# Altium project Apollo_ES_board.PrjPcb
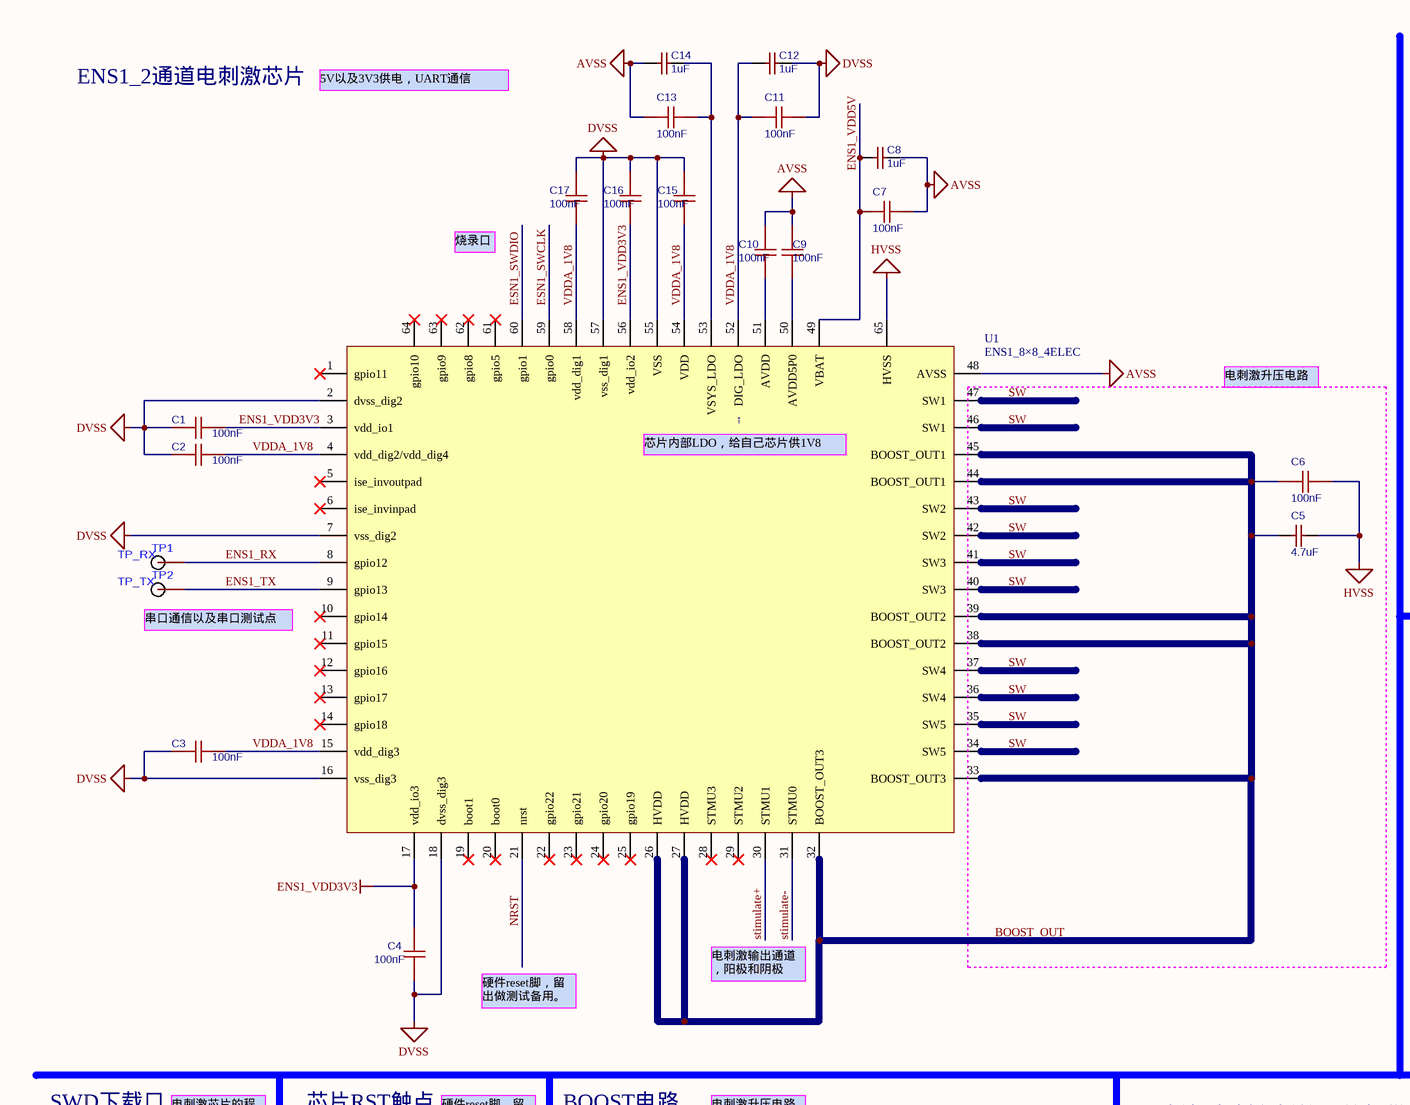
[diagram p0: Apollo_ES_Board.SchDoc, top left]
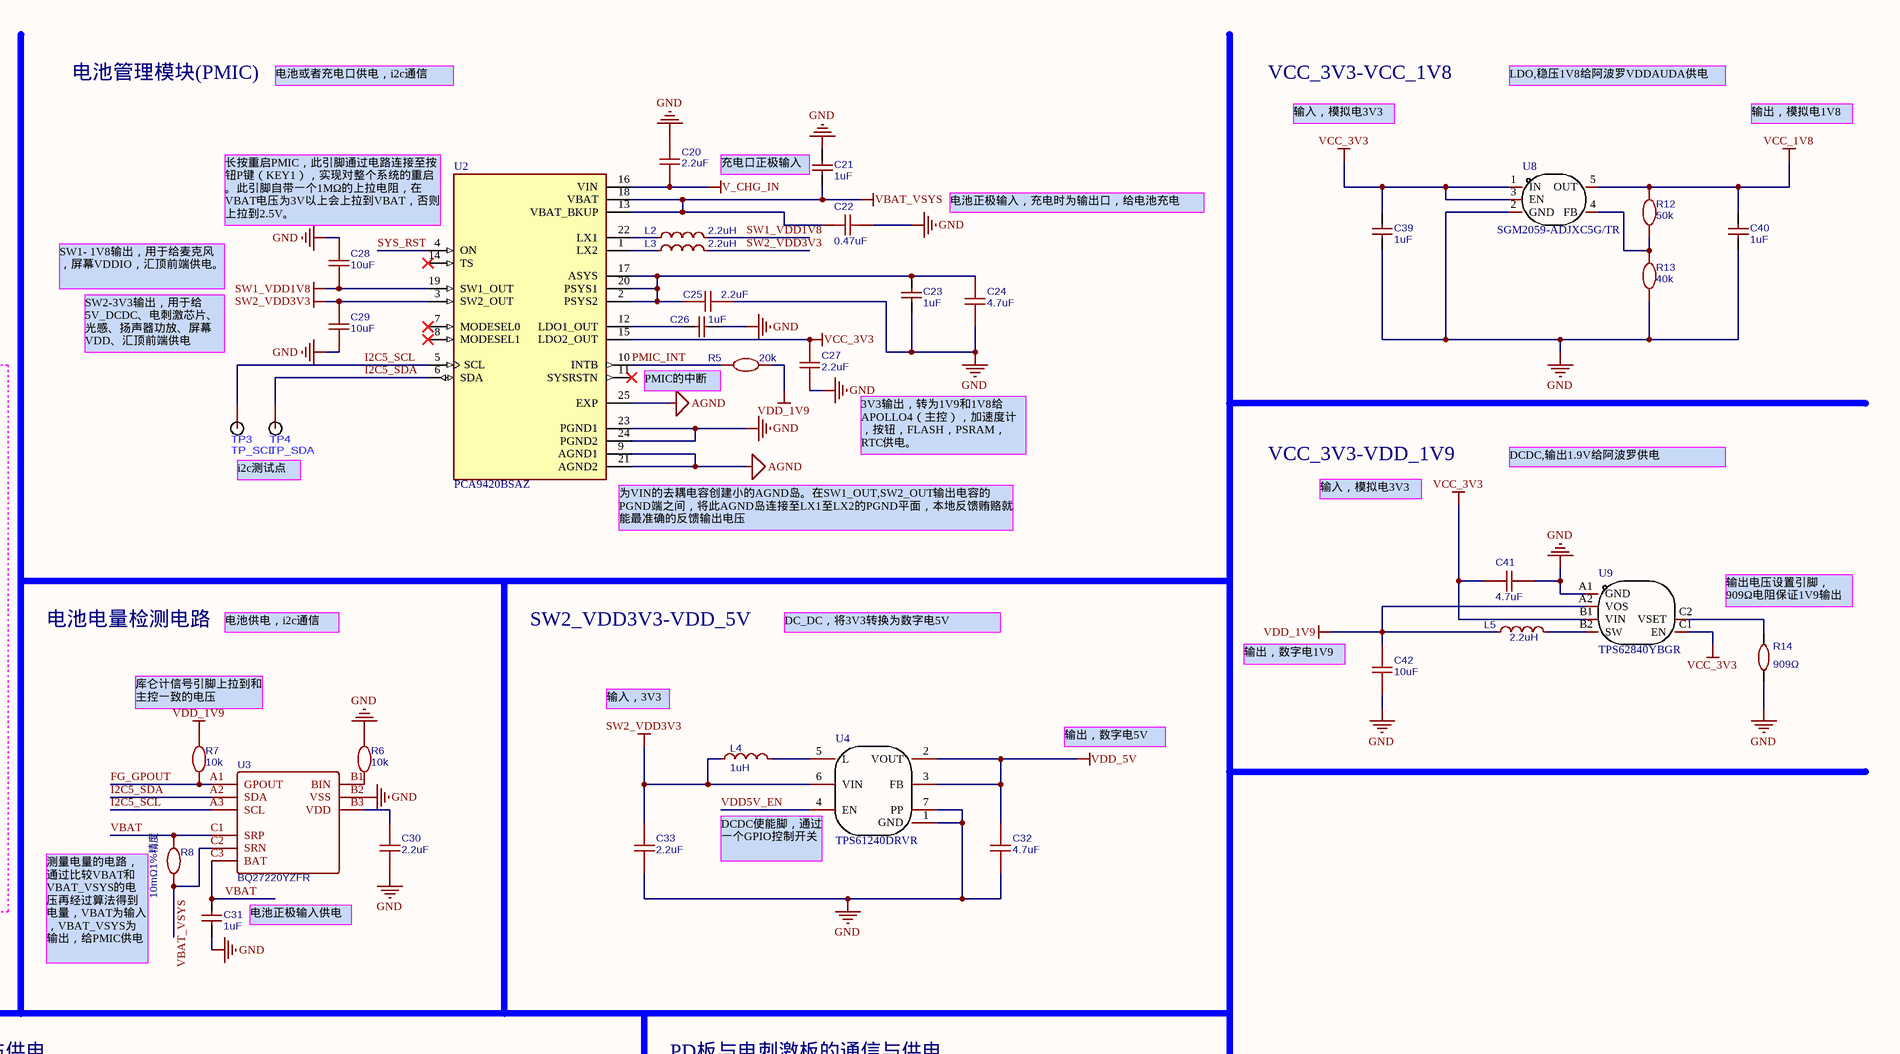
[diagram p1: Apollo_ES_Board.SchDoc, top right]
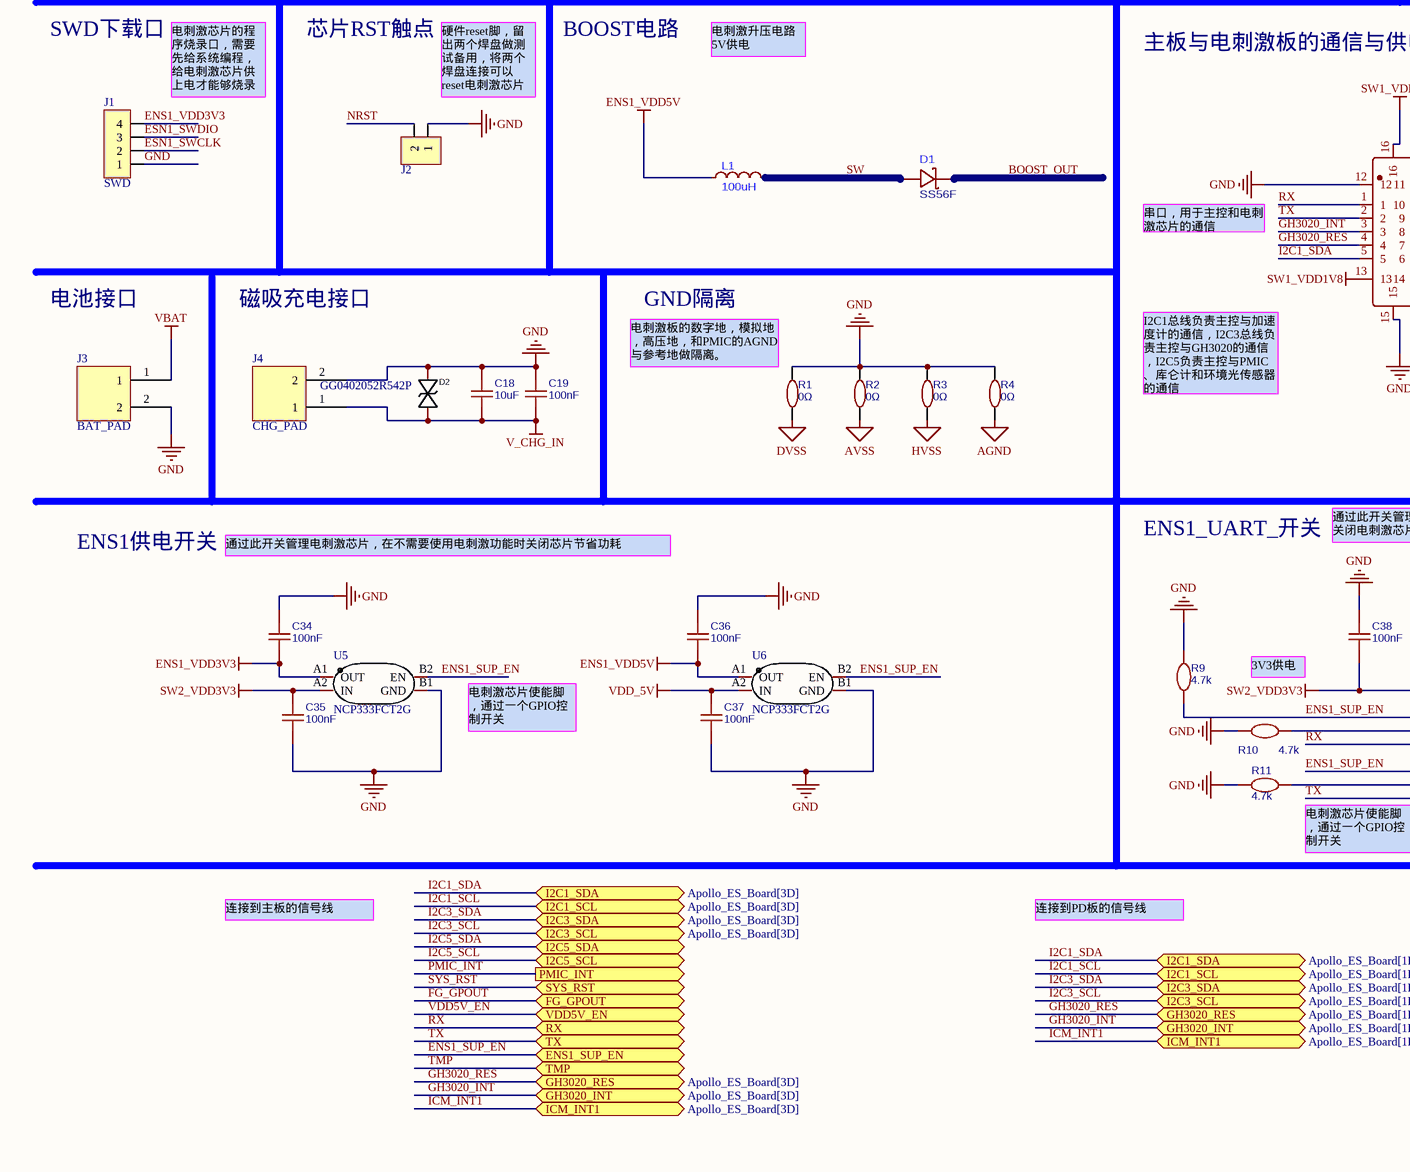
[diagram p2: Apollo_ES_Board.SchDoc, bottom left]
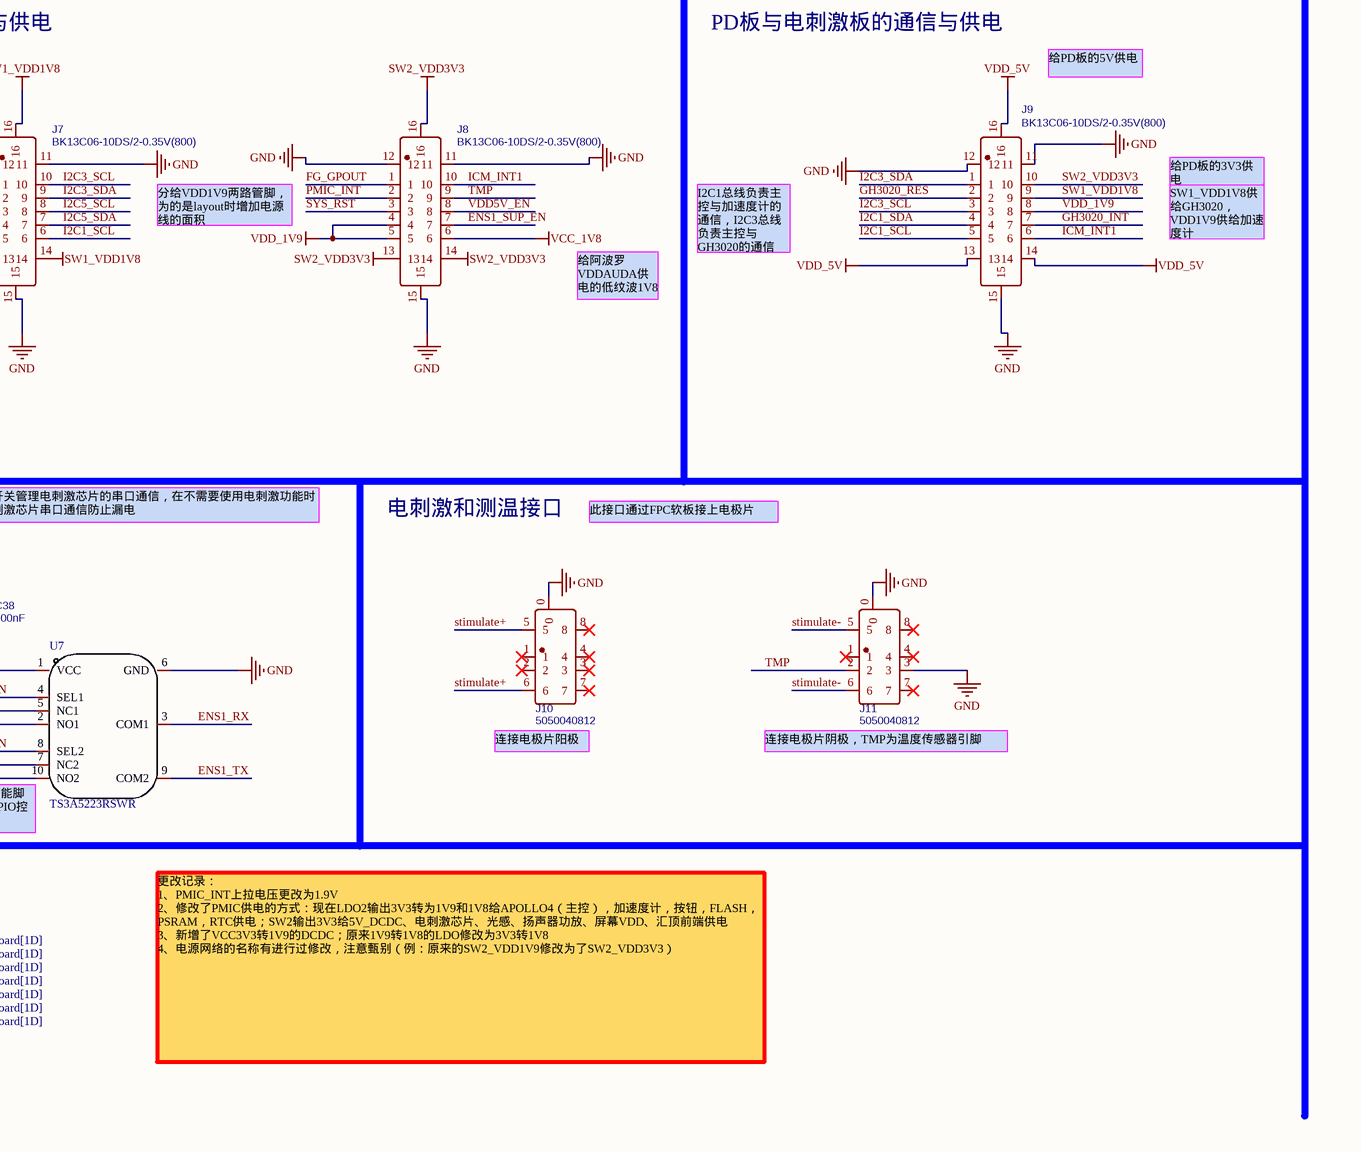
[diagram p3: Apollo_ES_Board.SchDoc, bottom right]
1 sheet, 85 parts. Net scope: flat (ports and power ports of the same name join across sheets).
Board files: Apollo_ES_Board_exercise.PcbDoc, Apollo_ES_Board-V1.1 1.PcbDoc

## Sheet Apollo_ES_Board.SchDoc
size 635 x 419 mm; SheetNumber: 1; SheetTotal: 1

### Parts
C1  100nF  [C0201]
C2  100nF  [C0201]
C3  100nF  [C0201]
C4  100nF  [C0201]
C5  4.7uF  [C1206]
C6  100nF  [C0805]
C7  100nF  [C0201]
C8  1uF  [C0201]
C9  100nF  [C0201]
C10  100nF  [C0201]
C11  100nF  [C0201]
C12  1uF  [C0201]
C13  100nF  [C0201]
C14  1uF  [C0201]
C15  100nF  [C0201]
C16  100nF  [C0201]
C17  100nF  [C0201]
C18  10uF  [C0402]
C19  100nF  [C0201]
C20  2.2uF  [C0201]
C21  1uF  [C0201]
C22  0.47uF  [C0201]
C23  1uF  [C0201]
C24  4.7uF  [C0201]
C25  2.2uF  [C0201]
C26  1uF  [C0201]
C27  2.2uF  [C0201]
C28  10uF  [C0402]
C29  10uF  [C0402]
C30  2.2uF  [C0201]
C31  1uF  [C0201]
C32  4.7uF  [C0201]
C33  2.2uF  [C0201]
C34  100nF  [C0201]
C35  100nF  [C0201]
C36  100nF  [C0201]
C37  100nF  [C0201]
C38  100nF  [C0201]
C39  1uF  [C0201]
C40  1uF  [C0201]
C41  4.7uF  [C0201]
C42  10uF  [C0402]
D1  SS56F  [SMAF_L3.5-W2.6-LS4.7-RD]
D2  GG0402052R542P  [0402]
J1  SWD  [4PIN_1.27mm]
J2  (no value)  [2PIN_1.27mm]
J3  BAT_PAD  [MOTOR_PAD]
J4  CHG_PAD  [CHG_PAD]
J7  BK13C06-10DS/2-0.35V(800)  [CONN-SMD_BK13C06-10DS-2-0.35V-800]
J8  BK13C06-10DS/2-0.35V(800)  [CONN-SMD_BK13C06-10DS-2-0.35V-800]
J9  BK13C06-10DS/2-0.35V(800)  [CONN-SMD_BK13C06-10DS-2-0.35V-800]
J10  5050040812  [CONN-SMD_4P-P0.40_5050040812]
J11  5050040812  [CONN-SMD_4P-P0.40_5050040812]
L1  100uH  [IND-SMD_L3.0-W3.0_SMNR3015]
L2  2.2uH  [L0805]
L3  2.2uH  [L0805]
L4  1uH  [IND-SMD_L2.5-W2.0_FNR252012S]
L5  2.2uH  [C0603]
R1  0Ω  [0402]
R2  0Ω  [0402]
R3  0Ω  [C0603]
R4  0Ω  [0402]
R5  20k  [RES0201]
R6  10k  [RES0201]
R7  10k  [RES0201]
R8  10mΩ1%精度  [0402]
R9  4.7k  [RES0201]
R10  4.7k  [RES0201]
R11  4.7k  [RES0201]
R12  50k  [C0603]
R13  40k  [C0603]
R14  909Ω  [0402]
TP1  TP_RX  [Testpoint]
TP2  TP_TX  [Testpoint]
TP3  TP_SCL  [Testpoint]
TP4  TP_SDA  [Testpoint]
U1  ENS1_8×8_4ELEC  [QFN64P800X800X90_HS-65L]
U2  PCA9420BSAZ  [IC_PCA9420BSAZ]
U3  BQ27220YZFR  [DSBGA-9_L1.7-W1.6-R3-C3-P0.50-BL]
U4  TPS61240DRVR  [WSON-6_L2.0-W2.0-P0.65-TL-EP]
U5  NCP333FCT2G  [WLCSP-4_L0.8-W0.8-R2-C2-P0.40-BL]
U6  NCP333FCT2G  [WLCSP-4_L0.8-W0.8-R2-C2-P0.40-BL]
U7  TS3A5223RSWR  [QFN-10_L1.4-W1.8-P0.40-BL]
U8  SGM2059-ADJXC5G/TR  [SC-70-5_L2.1-W1.3-P0.65-LS2.2-BR]
U9  TPS62840YBGR  [DSBGA-6_L1.4-W1.0-R2-C3-P0.40-BL]

### Ports
ENS1_SUP_EN (bidir), FG_GPOUT (bidir), GH3020_INT (bidir, see Apollo_ES_Board[1D]), GH3020_INT (bidir, see Apollo_ES_Board[3D]), GH3020_RES (bidir, see Apollo_ES_Board[1D]), GH3020_RES (bidir, see Apollo_ES_Board[3D]), I2C1_SCL (bidir, see Apollo_ES_Board[1D]), I2C1_SCL (bidir, see Apollo_ES_Board[3D]), I2C1_SDA (bidir, see Apollo_ES_Board[1D]), I2C1_SDA (bidir, see Apollo_ES_Board[3D]), I2C3_SCL (bidir, see Apollo_ES_Board[1D]), I2C3_SCL (bidir, see Apollo_ES_Board[3D]), I2C3_SDA (bidir, see Apollo_ES_Board[1D]), I2C3_SDA (bidir, see Apollo_ES_Board[3D]), I2C5_SCL (bidir), I2C5_SDA (bidir), ICM_INT1 (bidir, see Apollo_ES_Board[1D]), ICM_INT1 (bidir, see Apollo_ES_Board[3D]), PMIC_INT (out), RX (bidir), SYS_RST (bidir), TMP (bidir), TX (bidir), VDD5V_EN (bidir)

### Nets
AGND: R4.1 U2.9(AGND1) U2.21(AGND2) U2.25(EXP)
AVSS: C7.2 C8.1 C9.2 C10.2 C13.1 C14.2 R2.1 U1.48(AVSS)
DVSS: C1.2 C2.2 C3.2 C4.2 C11.2 C12.1 C15.2 C16.2 C17.2 R1.1 U1.2(dvss_dig2) U1.7(vss_dig2) U1.16(vss_dig3) U1.18(dvss_dig3) U1.55(VSS) U1.57(vss_dig1)
ENS1_VDD3V3: C1.1 C4.1 C16.1 C34.1 J1.4 U1.3(vdd_io1) U1.17(vdd_io3) U1.56(vdd_io2) U5.A1(OUT)
ENS1_VDD5V: C7.1 C8.2 C36.1 L1.1 U1.49(VBAT) U6.A1(OUT)
GND: C18.2 C19.1 C20.2 C21.1 C22.2 C23.2 C24.2 C25.1 C26.2 C27.2 C28.2 C29.1 C30.2 C31.2 C32.2 C33.2 C34.2 C35.1 C36.2 C37.1 C38.2 C39.2 C40.2 C41.2 C42.1 D2.2 J1.1 J2.1 J3.2 J4.2 J7.11 J7.12 J7.15 J8.11 J8.12 J8.15 J9.11 J9.12 J9.15 J10.0 J11.0 J11.3 R1.2 R2.2 R3.2 R4.2 R6.2 R9.1 R10.2 R11.2 R13.1 R14.1 U2.23(PGND1) U2.24(PGND2) U3.B2(VSS) U4.1(GND) U4.7(PP) U5.B1(GND) U6.B1(GND) U7.6(GND) U8.2(GND) U9.A1(GND)
HVSS: C5.2 C6.2 R3.1 U1.65(HVSS)
SW1_VDD1V8: C28.1 J7.13 J7.14 J7.16 J9.9 L2.2 U2.19(SW1_OUT)
SW2_VDD3V3: C29.2 C33.1 C35.2 C38.1 J8.13 J8.14 J8.16 J9.10 L3.2 L4.1 U2.3(SW2_OUT) U4.6(VIN) U5.A2(IN) U7.1(VCC)
V_CHG_IN: C18.1 C19.2 C20.1 D2.1 J4.1 U2.16(VIN)
VBAT: C31.1 J3.1 R8.2 U3.C1(SRP) U3.C3(BAT)
VBAT_VSYS: C21.2 C22.1 R8.1 U2.13(VBAT_BKUP) U2.18(VBAT) U3.C2(SRN)
VCC_1V8: C40.1 J8.6 R12.2 U8.5(OUT)
VCC_3V3: C27.1 C39.1 C41.1 U2.15(LDO2_OUT) U8.1(IN) U8.3(EN) U9.B1(VIN) U9.C1(EN)
VDD_1V9: C42.2 J8.4 J8.5 J9.8 L5.1 R5.2 R7.2 U9.A2(VOS)
VDD_5V: C32.1 C37.2 J9.13 J9.14 J9.16 U4.2(VOUT) U4.3(FB) U6.A2(IN)
BOOST_OUT: C5.1 C6.1 D1.1(K) U1.26(HVDD) U1.27(HVDD) U1.32(BOOST_OUT3) U1.33(BOOST_OUT3) U1.38(BOOST_OUT2) U1.39(BOOST_OUT2) U1.44(BOOST_OUT1) U1.45(BOOST_OUT1)
ENS1_RX: TP1.1(text) U1.8(gpio12) U7.3(COM1)
ENS1_SUP_EN: J8.7 R9.2 U5.B2(EN) U6.B2(EN) U7.4(SEL1) U7.8(SEL2) ; port ENS1_SUP_EN
ENS1_TX: TP2.1(text) U1.9(gpio13) U7.9(COM2)
ESN1_SWCLK: J1.2 U1.59(gpio0)
ESN1_SWDIO: J1.3 U1.60(gpio1)
FG_GPOUT: J8.1 R7.1 U3.A1(GPOUT) ; port FG_GPOUT
GH3020_INT: J7.3 J9.7 ; port GH3020_INT
GH3020_RES: J7.4 J9.2 ; port GH3020_RES
I2C1_SCL: J7.6 J9.5 ; port I2C1_SCL
I2C1_SDA: J7.5 J9.4 ; port I2C1_SDA
I2C3_SCL: J7.10 J9.3 ; port I2C3_SCL
I2C3_SDA: J7.9 J9.1 ; port I2C3_SDA
I2C5_SCL: J7.8 TP3.1(text) U2.5(SCL) U3.A3(SCL) ; port I2C5_SCL
I2C5_SDA: J7.7 TP4.1(text) U2.6(SDA) U3.A2(SDA) ; port I2C5_SDA
ICM_INT1: J8.10 J9.6 ; port ICM_INT1
NRST: J2.2 U1.21(nrst)
PMIC_INT: J8.2 R5.1 U2.10(INTB) ; port PMIC_INT
RX: J7.1 U7.2(NO1) ; port RX
stimulate+: J10.5 J10.6 U1.30(STMU1)
stimulate-: J11.5 J11.6 U1.31(STMU0)
SW: D1.2(A) L1.2 U1.34(SW5) U1.35(SW5) U1.36(SW4) U1.37(SW4) U1.40(SW3) U1.41(SW3) U1.42(SW2) U1.43(SW2) U1.46(SW1) U1.47(SW1)
SYS_RST: J8.3 U2.4(ON) ; port SYS_RST
TMP: J8.9 J11.2 ; port TMP
TX: J7.2 U7.10(NO2) ; port TX
VDD5V_EN: J8.8 U4.4(EN) ; port VDD5V_EN
VDDA_1V8: C2.1 C3.1 C11.1 C12.2 C15.1 C17.1 U1.4(vdd_dig2/vdd_dig4) U1.15(vdd_dig3) U1.52(DIG_LDO) U1.54(VDD) U1.58(vdd_dig1)
NetC9_1: C9.1 U1.50(AVDD5P0)
NetC10_1: C10.1 U1.51(AVDD)
NetC13_2: C13.2 C14.1 U1.53(VSYS_LDO)
NetC23_1: C23.1 C24.1 C25.2 U2.2(PSYS2) U2.17(ASYS) U2.20(PSYS1)
NetC26_1: C26.1 U2.12(LDO1_OUT)
NetC30_1: C30.1 U3.B3(VDD)
NetL2_1: L2.1 U2.22(LX1)
NetL3_1: L3.1 U2.1(LX2)
NetL4_2: L4.2 U4.5(L)
NetL5_2: L5.2 U9.B2(SW)
NetR6_1: R6.1 U3.B1(BIN)
NetR10_1: R10.1 U7.5(NC1)
NetR11_1: R11.1 U7.7(NC2)
NetR12_1: R12.1 R13.2 U8.4(FB)
NetR14_2: R14.2 U9.C2(VSET)

Not connected (* = marked no-connect by the designer): J10 1* 2* 3* 4* 7* 8*; J11 1* 4* 7* 8*; U1 1(gpio11)* 5(ise_invoutpad)* 6(ise_invinpad)* 10(gpio14)* 11(gpio15)* 12(gpio16)* 13(gpio17)* 14(gpio18)* 19(boot1)* 20(boot0)* 22(gpio22)* 23(gpio21)* 24(gpio20)* 25(gpio19)* 28(STMU3)* 29(STMU2)* 61(gpio5)* 62(gpio8)* 63(gpio9)* 64(gpio10)*; U2 7(MODESEL0)* 8(MODESEL1)* 11(SYSRSTN)* 14(TS)*

### Notes on the sheet
- ENS1_2通道电刺激芯片
- 5V以及3V3供电，UART通信
- 电池管理模块(PMIC)
- 电池或者充电口供电，i2c通信
- VCC_3V3-VCC_1V8
- LDO,稳压1V8给阿波罗VDDAUDA供电
- 输入，模拟电3V3
- 输出，模拟电1V8
- (near U2) 长按重启PMIC，此引脚通过电路连接至按钮P键（KEY1），实现对整个系统的重启。此引脚自带一个1MΩ的上拉电阻，在VBAT电压为3V以上会上拉到VBAT，否则上拉到2.5V。
- (near C21) 充电口正极输入
- 电池正极输入，充电时为输出口，给电池充电
- 烧录口
- SW1- 1V8输出，用于给麦克风，屏幕VDDIO，汇顶前端供电。
- SW2-3V3输出，用于给5V_DCDC、电刺激芯片、光感、扬声器功放、屏幕VDD、汇顶前端供电
- (near U1) ↑
- 电刺激升压电路
- (near R5) PMIC的中断
- (near U1) 芯片内部LDO，给自己芯片供1V8
- i2c测试点
- 3V3输出，转为1V9和1V8给APOLLO4（主控），加速度计，按钮，FLASH，PSRAM，RTC供电。
- VCC_3V3-VDD_1V9
- DCDC,输出1.9V给阿波罗供电
- (near U2) 为VIN的去耦电容创建小的AGND岛。在SW1_OUT,SW2_OUT输出电容的PGND端之间，将此AGND岛连接至LX1至LX2的PGND平面，本地反馈贿赂就能最准确的反馈输出电压
- (near TP2) 串口通信以及串口测试点
- 输出电压设置引脚，909Ω电阻保证1V9输出
- 电池电量检测电路
- 电池供电，i2c通信
- SW2_VDD3V3-VDD_5V
- DC_DC，将3V3转换为数字电5V
- (near C42) 输出，数字电1V9
- (near R7) 库仑计信号引脚上拉到和主控一致的电压
- 输入，3V3
- 输出，数字电5V
- (near U4) DCDC使能脚，通过一个GPIO控制开关
- 电刺激输出通道，阳极和阴极
- 电池正极输入供电
- 硬件reset脚，留出做测试备用。
- (near R8) 测量电量的电路，通过比较VBAT和VBAT_VSYS的电压再经过算法得到电量，VBAT为输入，VBAT_VSYS为输出，给PMIC供电
- SWD下载口
- 芯片RST触点
- BOOST电路
- (near J1) 电刺激芯片的程序烧录口，需要先给系统编程，给电刺激芯片供上电才能够烧录
- (near J2) 硬件reset脚，留出两个焊盘做测试备用，将两个焊盘连接可以reset电刺激芯片。
- 电刺激升压电路
  5V供电
- 主板与电刺激板的通信与供电
- PD板与电刺激板的通信与供电
- 给PD板的5V供电
- 串口，用于主控和电刺激芯片的通信
- 分给VDD1V9两路管脚，为的是layout时增加电源线的面积
- 给PD板的3V3供电
- 电池接口
- 磁吸充电接口
- GND隔离
- I2C1总线负责主控与加速度计的通信，I2C3总线负责主控与GH3020的通信
- SW1_VDD1V8供给GH3020，VDD1V9供给加速度计
- (near R1) 电刺激板的数字地，模拟地，高压地，和PMIC的AGND与参考地做隔离。
- 给阿波罗VDDAUDA供电的低纹波1V8
- I2C1总线负责主控与加速度计的通信，I2C3总线负责主控与GH3020的通信，I2C5负责主控与PMIC、库仑计和环境光传感器的通信
- ENS1供电开关
- 通过此开关管理电刺激芯片，在不需要使用电刺激功能时关闭芯片节省功耗
- ENS1_UART_开关
- 通过此开关管理电刺激芯片的串口通信，在不需要使用电刺激功能时关闭电刺激芯片串口通信防止漏电
- 电刺激和测温接口
- 此接口通过FPC软板接上电极片
- 3V3供电
- 电刺激芯片使能脚，通过一个GPIO控制开关
- (near J10) 连接电极片阳极
- (near J11) 连接电极片阴极，TMP为温度传感器引脚
- (near U7) 电刺激芯片使能脚，通过一个GPIO控制开关
- 连接到主板的信号线
- 连接到PD板的信号线
- 更改记录：
  1、PMIC_INT上拉电压更改为1.9V
  2、修改了PMIC供电的方式：现在LDO2输出3V3转为1V9和1V8给APOLLO4（主控），加速度计，按钮，FLASH，PSRAM，RTC供电；SW2输出3V3给5V_DCDC、电刺激芯片、光感、扬声器功放、屏幕VDD、汇顶前端供电
  3、新增了VCC3V3转1V9的DCDC；原来1V9转1V8的LDO修改为3V3转1V8
  4、电源网络的名称有进行过修改，注意甄别（例：原来的SW2_VDD1V9修改为了SW2_VDD3V3）

### Library data of the parts
C1-C4 C7 C9-C11 C13 C15-C17 C19 C34-C38 = 100nF: CL03A104KO3NNNC / 额定电压: 16V / 材质(温度系数): X5R; BOM_Manufacturer: SAMSUNG(三星); BOM_Manufacturer Part: CL10B104KB8NNNC; nameAlias: Capacitance; BOM_Supplier: LCSC; BOM_Supplier Part: C1591; BOM_JLCPCB Part Class: Extended Part; spicePre: C; spiceSymbolName: CL10B104KB8NNNC
C5 = 1uF: GRM31CC72A475KE11L / 品牌: muRata(村田) / 封装: 1206 / 容值: 4.7uF / 精度: ±10% / 额定电压: 100V / 材质(温度系数): X7S; BOM_Manufacturer Part: CL10A105KB8NNNC; BOM_Manufacturer: SAMSUNG(三星); nameAlias: Capacitance; BOM_Supplier: LCSC; BOM_Supplier Part: C15849; BOM_JLCPCB Part Class: Basic Part; spicePre: C; spiceSymbolName: CL10A105KB8NNNC
C6 = 100nF: GCM21BR72A104KA37L / 品牌: muRata(村田) / 封装: 0805 / 容值: 100nF / 精度: ±10% / 额定电压: 100V / 材质(温度系数): X7R; BOM_Manufacturer: SAMSUNG(三星); BOM_Manufacturer Part: CL10B104KB8NNNC; nameAlias: Capacitance; BOM_Supplier: LCSC; BOM_Supplier Part: C1591; BOM_JLCPCB Part Class: Extended Part; spicePre: C; spiceSymbolName: CL10B104KB8NNNC
C8 C12 C14 C21 C23 C26 C31 C39 C40 = 1uF: GRM033R61A105ME44D / 精度: ±20% / 额定电压: 10V / 材质(温度系数): X5R; BOM_Manufacturer Part: CL10A105KB8NNNC; BOM_Manufacturer: SAMSUNG(三星); nameAlias: Capacitance; BOM_Supplier: LCSC; BOM_Supplier Part: C15849; BOM_JLCPCB Part Class: Basic Part; spicePre: C; spiceSymbolName: CL10A105KB8NNNC
C18 = 10uF: CL05A106MQ5NUNC / 精度: ±20% / 额定电压: 6.3V / 材质(温度系数): X5R; BOM_Manufacturer: SAMSUNG(三星); BOM_Manufacturer Part: CL21A106KBYQNNE; nameAlias: Capacitance; Contributor: lcsc; BOM_Supplier: LCSC; BOM_Supplier Part: C2932476; BOM_JLCPCB Part Class: Extended Part; spicePre: C; spiceSymbolName: CL21A106KBYQNNE
C20 C25 C27 C30 C33 = C0201: GRM033R61A225KE47D / 品牌: muRata(村田) / 封装: 0201 / 容值: 2.2uF / 精度: ±10% / 额定电压: 10V / 材质(温度系数): X5R; BOM_Manufacturer: SAMSUNG(三星); BOM_Manufacturer Part: CL10A225KB8NNNC; Contributor: LCSC; nameAlias: Capacitance; BOM_Supplier: LCSC; BOM_Supplier Part: C913904; BOM_JLCPCB Part Class: Extended Part; spicePre: C; spiceSymbolName: CL10A225KB8NNNC
C22 = C0201: GRM033R60J474KE90D / 品牌: muRata(村田) / 封装: 0201 / 容值: 470nF / 精度: ±10% / 额定电压: 6.3V / 材质(温度系数): X5R; BOM_Manufacturer: SAMSUNG(三星); BOM_Manufacturer Part: CL10A225KB8NNNC; Contributor: LCSC; nameAlias: Capacitance; BOM_Supplier: LCSC; BOM_Supplier Part: C913904; BOM_JLCPCB Part Class: Extended Part; spicePre: C; spiceSymbolName: CL10A225KB8NNNC
C24 C32 C41 = 4.7uF: GRM035R60J475ME15D / 品牌: muRata(村田) / 封装: 0201 / 容值: 4.7uF / 精度: ±20% / 额定电压: 6.3V / 材质(温度系数): X5R; BOM_Manufacturer Part: GRM31CC72A475KE11L; nameAlias: Capacitance; Contributor: LCSC; BOM_Supplier: LCSC; BOM_Supplier Part: C237304; BOM_Manufacturer: muRata(村田); BOM_JLCPCB Part Class: Extended Part; spicePre: C; spiceSymbolName: GRM31CC72A475KE11L
C28 C29 C42 = C0402: CL05A106MQ5NUNC / 品牌: SAMSUNG(三星) / 封装: 0402 / 容值: 10uF / 精度: ±20% / 额定电压: 6.3V / 材质(温度系数): X5R; BOM_Manufacturer Part: CL10A225KB8NNNC; Contributor: LCSC; nameAlias: Capacitance; BOM_Supplier: LCSC; BOM_Supplier Part: C913904; BOM_Manufacturer: SAMSUNG(三星); BOM_JLCPCB Part Class: Extended Part; spicePre: C; spiceSymbolName: CL10A225KB8NNNC
D2 = GG0402052R542P: GG0402052R542P / 品牌: Kyocera AVX / 封装: 0402 / 反向截止电压(Vrwm): 5V / 最大钳位电压: 15.5V / 峰值脉冲电流(Ipp): 3A@8/20us / 峰值脉冲功率(Ppp): 46W; Add into BOM: yes; Breakdown Voltage (Min): 5.5V; Name: GG0402052R542P; Symbol: GG0402052R542P; Device: GG0402052R542P; LCSC Part Name: Vrwm:5V 46W; Supplier Part: C1973257; Manufacturer: Kyocera AVX; Manufacturer Part: GG0402052R542P; Supplier Footprint: 0402; JLCPCB Part Class: Extended Part; Datasheet: https://atta.szlcsc.comnull; Supplier: LCSC; Convert to PCB: yes; Reverse Stand-Off Voltage (Vrwm): 5V; Peak Pulse Current (Ipp)@10/1000μs: 3A@8/20us; Maximum Clamping Voltage: 15.5V; Peak Pulse Power Dissipation (Ppp)@10/1000μs: 46W
J1 = Header 4: Header, 4-Pin; LatestRevisionDate: 17-Jul-2002; LatestRevisionNote: Re-released for DXP Platform.; Publisher: Altium Limited
J2 = Header 2: Header, 2-Pin, encryption interface; LatestRevisionDate: 17-Jul-2002; LatestRevisionNote: Re-released for DXP Platform.; Publisher: Altium Limited
J3 = MOTOR_PAD
J7-J9 = 10pin_ds_BK13C06-10DS/2-0.35V(800): Manufacturer: HRS(广濑); Contributor: lcsc; Supplier: LCSC; Supplier Part: C3024358; Manufacturer Part: BK13C06-10DS/2-0.35V(800); JLCPCB Part Class: Extended Part; spicePre: C; spiceSymbolName: BK13C06-10DS/2-0.35V(800)
J10 J11 = 5050040812_8pin_ds: Manufacturer: MOLEX; Contributor: lcsc; Supplier: LCSC; Supplier Part: C724121; Manufacturer Part: 5050040812; JLCPCB Part Class: Extended Part; spicePre: U; spiceSymbolName: 5050040812
L1 = YNR6045-101M: XRNR3015-100uH，±20%
L2 L3 = 1uH_1.8A: DFE201210U-2R2M=P2 / 品牌: muRata(村田) / 封装: 0805 / 电感值: 2.2uH / 精度: ±20% / 额定电流: 1.2A / 饱和电流(Isat): 2A; Manufacturer: cjiang(长江微电); Manufacturer Part: FNR252010S1R0NT; nameAlias: Value; Contributor: LCSC; Supplier: LCSC; Supplier Part: C167680; JLCPCB Part Class: Extended Part; spicePre: L; spiceSymbolName: FNR252010S1R0NT
L4 = 1uH_1.8A: FNR252012S1R0NT / 品牌: cjiang(长江微电) / 封装: 1008 / 描述: SMD，2.5x2x1.2mm / 电感值: 1uH / 精度: ±30% / 额定电流: 2.1A / 饱和电流(Isat): 2.9A; Manufacturer Part: FNR252010S1R0NT; nameAlias: Value; Contributor: LCSC; Supplier: LCSC; Manufacturer: cjiang(长江微电); Supplier Part: C167680; JLCPCB Part Class: Extended Part; spicePre: L; spiceSymbolName: FNR252010S1R0NT
L5 = 1uH_1.8A: LQM18PN2R2MFRL / 品牌: muRata(村田) / 封装: 0603 / 电感值: 2.2uH / 精度: ±20% / 额定电流: 750mA / 直流电阻(DCR): 300mΩ; Manufacturer: cjiang(长江微电); Manufacturer Part: FNR252010S1R0NT; nameAlias: Value; Contributor: LCSC; Supplier: LCSC; Supplier Part: C167680; JLCPCB Part Class: Extended Part; spicePre: L; spiceSymbolName: FNR252010S1R0NT
R1 R2 R4 = 0Ω: FRC0402F0000TS，±1%; BOM_Manufacturer: PANASONIC(松下); BOM_Manufacturer Part: ERJ3GEY0R00V; nameAlias: Resistance; Resistance (Ohms): 0; BOM_Supplier: LCSC; BOM_Supplier Part: C122704; BOM_JLCPCB Part Class: Extended Part; spicePre: R; spiceSymbolName: ERJ-3GEY0R00V
R3 = 0Ω: 0603WAF0000T5E，±1%，100mW，最大工作电压75V; BOM_Manufacturer: PANASONIC(松下); BOM_Manufacturer Part: ERJ3GEY0R00V; nameAlias: Resistance; Resistance (Ohms): 0; BOM_Supplier: LCSC; BOM_Supplier Part: C122704; BOM_JLCPCB Part Class: Extended Part; spicePre: R; spiceSymbolName: ERJ-3GEY0R00V
R5 = RES0402: 0201WMF2002TEE / 品牌: UNI-ROYAL(厚声) / 封装: 0201 / 电阻类型: 厚膜电阻 / 阻值: 20kΩ / 精度: ±1% / 功率: 50mW; BOM_Manufacturer Part: TC0325B1000T5F; Resistance: 100Ω; Contributor: lcsc; BOM_Supplier: LCSC; BOM_Supplier Part: C2989113; BOM_Manufacturer: UNI-ROYAL(厚声); link: https://atta.szlcsc.com/upload/public/pdf/source/20220708/6ACD1707201702E70C0F417A19EB926E.pdf; spicePre: U; spiceSymbolName: TC0325B1000T5F
R6 R7 = RES0201: 0201WMF1002TEE / 品牌: UNI-ROYAL(厚声) / 封装: 0201 / 电阻类型: 厚膜电阻 / 阻值: 10kΩ / 精度: ±1% / 功率: 50mW; BOM_Manufacturer Part: TC0325B1000T5F; Resistance: 100Ω; Contributor: lcsc; BOM_Supplier: LCSC; BOM_Supplier Part: C2989113; BOM_Manufacturer: UNI-ROYAL(厚声); link: https://atta.szlcsc.com/upload/public/pdf/source/20220708/6ACD1707201702E70C0F417A19EB926E.pdf; spicePre: U; spiceSymbolName: TC0325B1000T5F
R8 = RES0402: 品牌: Milliohm(毫欧) / 封装: 0402 / 电阻类型: 陶瓷电阻 / 阻值: 10mΩ / 精度: ±1% / 功率: 250mW; BOM_Manufacturer: UNI-ROYAL(厚声); BOM_Manufacturer Part: TC0325B1000T5F; Resistance: 100Ω; Contributor: lcsc; BOM_Supplier: LCSC; BOM_Supplier Part: C2989113; link: https://atta.szlcsc.com/upload/public/pdf/source/20220708/6ACD1707201702E70C0F417A19EB926E.pdf; spicePre: U; spiceSymbolName: TC0325B1000T5F
R9-R11 = RES0201: 0201WMF4701TEE / 品牌: UNI-ROYAL(厚声) / 封装: 0201 / 电阻类型: 厚膜电阻 / 阻值: 4.7kΩ / 精度: ±1% / 功率: 50mW; BOM_Manufacturer Part: TC0325B1000T5F; Resistance: 100Ω; Contributor: lcsc; BOM_Supplier: LCSC; BOM_Supplier Part: C2989113; BOM_Manufacturer: UNI-ROYAL(厚声); link: https://atta.szlcsc.com/upload/public/pdf/source/20220708/6ACD1707201702E70C0F417A19EB926E.pdf; spicePre: U; spiceSymbolName: TC0325B1000T5F
R12 = RES0201: AR03BTC5002A / 品牌: Viking(光颉) / 封装: 0603 / 阻值: 50kΩ / 精度: ±0.1% / 功率: 62.5mW / 温度系数: ±25ppm/℃; BOM_Manufacturer: UNI-ROYAL(厚声); BOM_Manufacturer Part: TC0325B1000T5F; Resistance: 100Ω; Contributor: lcsc; BOM_Supplier: LCSC; BOM_Supplier Part: C2989113; link: https://atta.szlcsc.com/upload/public/pdf/source/20220708/6ACD1707201702E70C0F417A19EB926E.pdf; spicePre: U; spiceSymbolName: TC0325B1000T5F
R13 = RES0201: SCR0603F40K / 品牌: VO(翔胜) / 封装: 0603 / 电阻类型: 厚膜电阻 / 阻值: 40kΩ / 精度: ±1% / 功率: 100mW; BOM_Manufacturer: UNI-ROYAL(厚声); BOM_Manufacturer Part: TC0325B1000T5F; Resistance: 100Ω; Contributor: lcsc; BOM_Supplier: LCSC; BOM_Supplier Part: C2989113; link: https://atta.szlcsc.com/upload/public/pdf/source/20220708/6ACD1707201702E70C0F417A19EB926E.pdf; spicePre: U; spiceSymbolName: TC0325B1000T5F
R14 = 0Ω: FRC0402F9090TS / 品牌: FOJAN(富捷) / 封装: 0402 / 电阻类型: 厚膜电阻 / 阻值: 909Ω / 精度: ±1% / 功率: 62.5mW; BOM_Manufacturer: PANASONIC(松下); BOM_Manufacturer Part: ERJ3GEY0R00V; nameAlias: Resistance; Resistance (Ohms): 0; BOM_Supplier: LCSC; BOM_Supplier Part: C122704; BOM_JLCPCB Part Class: Extended Part; spicePre: R; spiceSymbolName: ERJ-3GEY0R00V
TP1-TP4 = TP
U2 = PCA9420BSAZ: Power Management IC 3.3V to 5.5V 24-Pin HVQFN EP T/R; MF: NXP Semiconductors; Check_prices: https://www.snapeda.com/parts/PCA9420BSAZ/NXP%20Semiconductors/view-part/5003095/?ref=eda; Price: None; SnapEDA_Link: https://www.snapeda.com/parts/PCA9420BSAZ/NXP%20Semiconductors/view-part/5003095/?ref=snap; MP: PCA9420BSAZ; Value: *; Availability: In Stock; Package: None
U3 = BQ27220YZFR: Manufacturer: TI(德州仪器); Contributor: LCSC; Supplier: LCSC; Supplier Part: C528617; Manufacturer Part: BQ27220YZFR; JLCPCB Part Class: Extended Part; spicePre: U; spiceSymbolName: BQ27220YZFR
U4 = TPS61240DRVR: Manufacturer: TI(德州仪器); Add into BOM: yes; Function: 升压型; Output Type: 固定; Input Voltage: 2.3V~5.5V; Output Voltage: 5V; Output Current (Max): 500mA; Switching Frequency: 3.5MHz; Synchronous Rectification: 是; Number of Outputs: 1; Topology: 升压式; Switch tube (built-in/external): 内置; Symbol: TPS61240DRVR; Device: TPS61240DRVR; Supplier: LCSC; Manufacturer Part: TPS61240DRVR; Supplier Part: C59567; JLCPCB Part Class: 扩展库; LCSC Part Name: TPS61240DRVR; Supplier Footprint: WSON-6-EP(2x2); Datasheet: https://www.ti.com/cn/lit/gpn/tps61240; Convert to PCB: yes; Operating Temperature: -40℃~+85℃@(TA); Name: TPS61240DRVR
U5 U6 = NCP333FCT2G: Manufacturer: onsemi(安森美); Add into BOM: yes; Number of Outputs: 1; Output Current: 1.5A; Input Voltage: 1.2V~5.5V; Resistor On-State: 45mΩ; Symbol: NCP333FCT2G; Device: NCP333FCT2G; LCSC Part Name: 负载开关，带放电路径，1.5 A; Supplier Part: C150074; Manufacturer Part: NCP333FCT2G; Supplier Footprint: WLCSP-4(0.8x0.8); JLCPCB Part Class: 扩展库; Datasheet: https://atta.szlcsc.com/upload/public/pdf/source/20180112/C150074_15157255990121261382.PDF; Supplier: LCSC; Convert to PCB: yes; Operating Temperature	-: -40℃~+125℃; Name: NCP333FCT2G
U7 = TS3A5223RSWR: Manufacturer: TI(德州仪器); Add into BOM: yes; Switch Circuit: 单刀双掷(SPDT); Number of Channels: 2; Supply Voltage: 1.65V~3.6V; Turn-on time: 70ns; On-State Resistance (Max): 600mΩ; Turn-off time: 75ns; Symbol: TS3A5223RSWR; Device: TS3A5223RSWR; LCSC Part Name: TS3A5223RSWR; Supplier Part: C128419; Manufacturer Part: TS3A5223RSWR; Supplier Footprint: QFN-10(1.8x1.4); JLCPCB Part Class: 扩展库; Datasheet: https://www.ti.com/cn/lit/gpn/ts3a5223; Supplier: LCSC; Convert to PCB: yes; Name: TS3A5223RSWR
U8 = SGM2059-ADJXC5G/TR: Manufacturer: SGMICRO(圣邦微); Add into BOM: yes; Symbol: SGM2059-ADJXC5G/TR; Device: SGM2059-ADJXC5G/TR; LCSC Part Name: SGM2059-ADJXC5G/TR; Supplier Part: C5153016; Manufacturer Part: SGM2059-ADJXC5G/TR; Supplier Footprint: SC-70-5; JLCPCB Part Class: 扩展库; Datasheet: https://atta.szlcsc.com/upload/public/pdf/source/20230206/2567E50B9DBA59F1F6F9ECD2B62ACFD5.pdf; Supplier: LCSC; Convert to PCB: yes; Name: SGM2059-ADJXC5G/TR
U9 = TPS62840YBGR: Manufacturer: TI(德州仪器); Add into BOM: yes; Function: 降压型; Output Type: 可调; Input Voltage: 1.8V~6.5V; Output Voltage: 1.8V~3.3V; Output Current: 750mA; Switching Frequency: 1.8MHz; Synchronous Rectification: 是; Number of Outputs: 1; Topology: 降压式; Switch tube (built-in/external): 内置; Symbol: TPS62840YBGR; Device: TPS62840YBGR; LCSC Part Name: TPS62840YBGR; Supplier Part: C2071139; Manufacturer Part: TPS62840YBGR; Supplier Footprint: DSBGA-6(1x1.5); JLCPCB Part Class: 扩展库; Datasheet: https://www.ti.com/cn/lit/gpn/tps62840; Supplier: LCSC; Convert to PCB: yes; Operating Temperature: -40℃~+125℃@(TJ); Name: TPS62840YBGR